# EAGLE design BreakoutV2 (EAGLE 6.1)
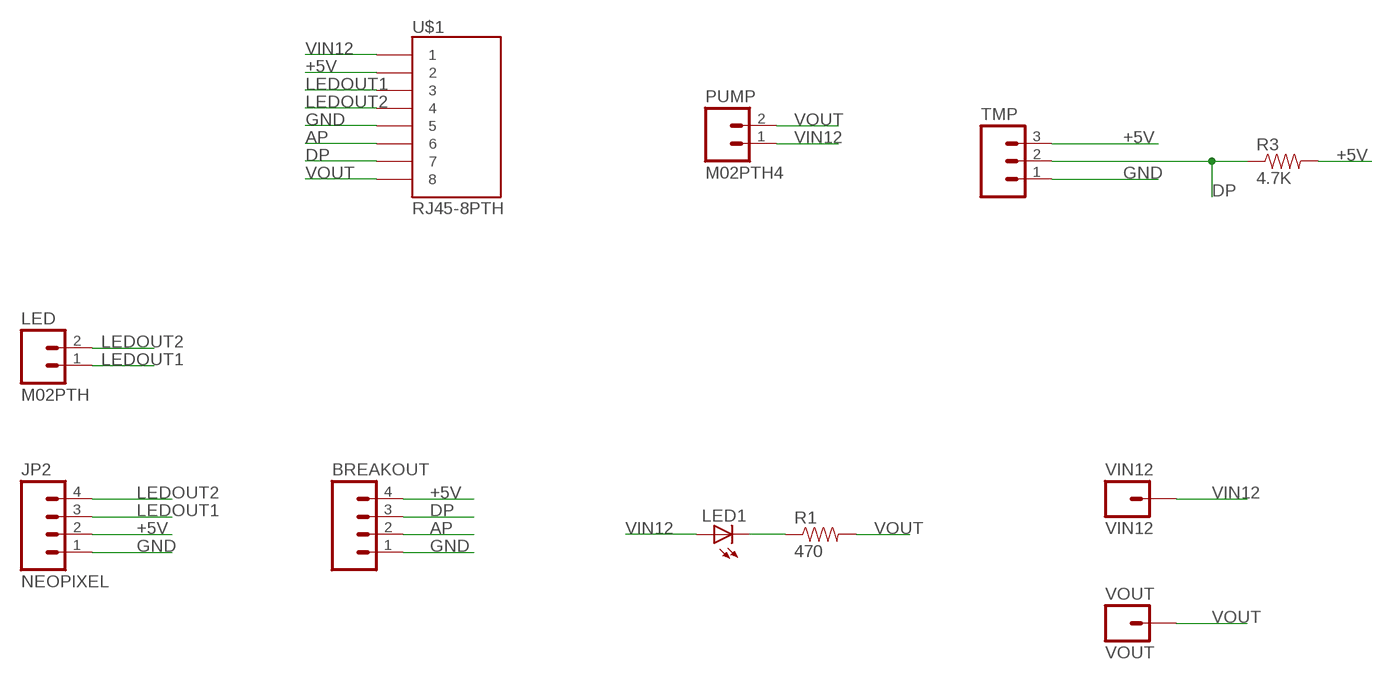
[diagram p0: schematic, sheet 1]

## Parts
BREAKOUT  M04PTH  [1X04]
JP2  NEOPIXEL  M04PTH  [1X04]
LED  M02PTH  [1X02]
LED1  LED5MM  [LED5MM]
PUMP  M02PTH4  [1X02_XTRA_BIG]
R1  470  RESISTORPTH-1/6W  [1/6W-RES]
R3  4.7K  RESISTORPTH-1/6W  [1/6W-RES]
TMP  M03PTH  [1X03]
U$1  RJ45-8PTH  [RJ45-8]
VIN12  VIN12  M01POGOPIN_HOLE_0.58  [1X01_POGOPIN_HOLE_0.58]
VOUT  VOUT  M01POGOPIN_HOLE_0.58  [1X01_POGOPIN_HOLE_0.58]

## Nets
+5V: BREAKOUT.4 JP2.2 R3.2 TMP.3 U$1.2
AP: BREAKOUT.2 U$1.6
DP: BREAKOUT.3 R3.1 TMP.2 U$1.7
GND: BREAKOUT.1 JP2.1 TMP.1 U$1.5
LEDOUT1: JP2.3 LED.1 U$1.3
LEDOUT2: JP2.4 LED.2 U$1.4
N$1: LED1.K(C) R1.1
VIN12: LED1.A PUMP.1 U$1.1 VIN12.1
VOUT: PUMP.2 R1.2 U$1.8 VOUT.1

## Library data of the parts
BREAKOUT JP2 = SparkFun-Connectors:M04: Header 4 Standard 4-pin 0.1" header. Use with straight break away headers (SKU : PRT-00116), right angle break away headers (PRT-00553), swiss pins (PRT-00743), machine pins (PRT-00117), and female headers (PRT-00115). Molex polarized connector foot print use with SKU : PRT-08231 with associated crimp pins and housings. 1MM SMD Version SKU: PRT-10208
LED PUMP = SparkFun-Connectors:M02: Standard 2-pin 0.1" header. Use with - straight break away headers ( PRT-00116) - right angle break away headers (PRT-00553) - swiss pins (PRT-00743) - machine pins (PRT-00117) - female headers (PRT-00115) Molex polarized connector foot print use with: PRT-08233 with associated crimp pins and housings. 2.54_SCREWTERM for use with PRT-10571. 3.5mm Screw Terminal footprints for PRT-08084 5mm Screw Terminal footprints for use with PRT-08433
LED1 = SparkFun-LED:LED: LEDs Standard schematic elements and footprints for 5mm, 3mm, 1206, and 0603 sized LEDs. 5mm - Spark Fun Electronics SKU : COM-00529 (and others)
R1 R3 = SparkFun-Resistors:RESISTOR: Resistor Basic schematic elements and footprints for 0603, 1206, and PTH resistors.
TMP = SparkFun-Connectors:M03: Header 3 Standard 3-pin 0.1" header. Use with straight break away headers (SKU : PRT-00116), right angle break away headers (PRT-00553), swiss pins (PRT-00743), machine pins (PRT-00117), and female headers (PRT-00115). Molex polarized connector foot print use with SKU : PRT-08232 with associated crimp pins and housings.
U$1 = SparkFun-Connectors:RJ45-8: RJ45 Jack Simple RJ45, 8-pin connection - connector for common Cat5, Cat5e, and Cat6 Ethernet cables. Footprint not yet proven in production. Connector sku is PRT-00643; Breakout PCB sku is BOB-00716.
VIN12 VOUT = SparkFun-Connectors:M01: Header 1 Standard 1-pin 0.1" header. Use with straight break away headers (SKU : PRT-00116), right angle break away headers (PRT-00553), swiss pins (PRT-00743), machine pins (PRT-00117), and female headers (PRT-00115).

## Board
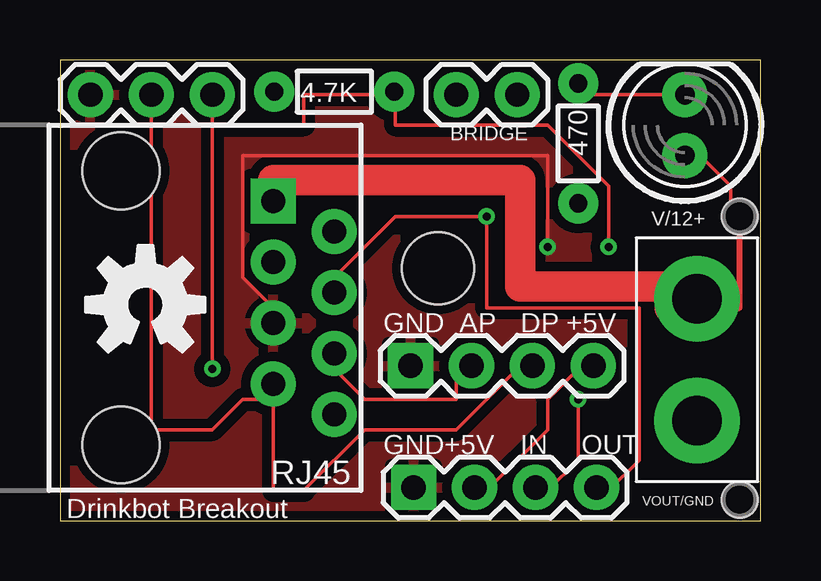
[diagram p1: board, top side]
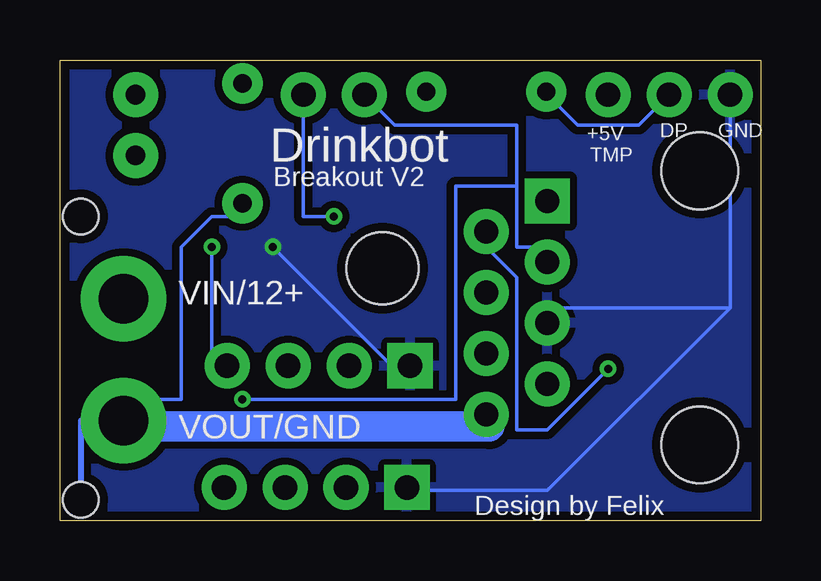
[diagram p2: board, bottom side, seen from below]

Size 29.19 x 19.23 mm. Coordinates in mm from the lower left corner, seen from the top.
Outline: 0,0 29.19,0 29.19,19.23 0,19.23 0,0
Copper layers (1*16): Top 0.0356mm / dielectric 1.5011mm / Bottom 0.0356mm
Design rules: minimum track width 6mil, minimum drill 13mil, track to track 6mil, track to pad 6mil, pad to pad 6mil, via to via 6mil, smd to smd 6mil, copper to edge 15mil, drill to drill 6mil, minimum pad ring 7mil, minimum via ring 7mil, stop-mask expansion 4mil, vias tented up to drill 0mil, thermal gap 10mil
Holes 3 mm at 15.75,10.54

### Footprints (pad centres in the part's own frame; a part is rotated, then mirrored left to right if it is on the bottom)
1X04 = drill 1.016 pad 1.88 square: 1 0,0 | drill 1.016 pad 1.88: 2 2.54,0; 3 5.08,0; 4 7.62,0
1X02 = drill 1.016 pad 1.88: 1 0,0; 2 2.54,0
LED5MM = drill 0.813 pad 1.88: A -1.27,0; K 1.27,0
1X02_XTRA_BIG = drill 2.057 pad 3.556: 1 -2.54,0; 2 2.54,0
1/6W-RES = drill 0.762 pad 1.676: 1 -2.5,0; 2 2.5,0
1X03 = drill 1.016 pad 1.88: 1 0,0; 2 2.54,0; 3 5.08,0
RJ45-8 = drill 1 pad 1.88 square: 1 -4.445,6.35 | drill 1 pad 1.88: 2 -3.175,8.89; 3 -1.905,6.35; 4 -0.635,8.89; 5 0.635,6.35; 6 1.905,8.89; 7 3.175,6.35; 8 4.445,8.89 | hole 3.2: -5.715,0; 5.715,0
1X01_POGOPIN_HOLE_0.58 = drill 0.9 pad 0.813: 1 0,0 | hole 1.473: 0,0

### Placement (x,y rotation side)
BREAKOUT  14.61,6.48 0 top
JP2  14.73,1.4 0 top
LED  16.51,17.78 0 top
LED1  26.04,16.51 90 top
PUMP  26.54,6.73 270 top
R1  21.59,15.75 270 top
R3  11.43,17.91 0 top
TMP  1.27,17.78 0 top
U$1  2.54,8.89 270 top
U$2  [OSHW-LOGO-M]  3.56,9.02 0 top
VIN12  28.32,12.7 0 top
VOUT  28.32,0.89 0 top

### Tracks (layer width: path | path; a pad name or v marks a point on that pad's centre or on a via)
+5V  (via drill 0.33)
  Top 0.152: JP2.2 17.78,1.27 20.32,3.81 20.32,5.08 21.59,6.35 BREAKOUT.4 | 13.97,17.78 10.16,17.78 10.16,16.51 6.35,16.51 | TMP.3 6.35,16.51 | 6.35,16.51 v6.35,6.35 | v22.86,11.43 22.86,13.97 20.32,16.51 13.97,16.51 13.97,17.78 | 13.97,17.78 R3.2
  Bottom 0.152: v6.35,6.35 8.89,3.81 10.16,3.81 10.16,10.16 11.43,11.43 U$1.2 | v22.86,11.43 22.86,6.35 BREAKOUT.4
AP
  Top 0.152: BREAKOUT.2 16.51,6.35 16.51,5.08 12.7,5.08 11.43,6.35 U$1.6
DP
  Top 0.152: 8.89,5.08 7.62,5.08 6.35,3.81 3.81,3.81 TMP.2 | 8.89,5.08 8.89,1.27 10.16,1.27 12.7,3.81 16.51,3.81 19.05,6.35 BREAKOUT.3 | 8.89,5.08 U$1.7
  Bottom 0.152: TMP.2 5.08,16.51 7.62,16.51 8.89,17.78 R3.1
GND  (via drill 0.33)
  Top 0.152: v20.32,11.43 20.32,15.24 7.62,15.24 7.62,10.16 8.89,8.89 U$1.5
  Bottom 0.152: 1.27,8.89 TMP.1 | 1.27,8.89 8.89,8.89 U$1.5 | 1.27,8.89 8.89,1.27 13.97,1.27 JP2.1 | v20.32,11.43 15.24,6.35 BREAKOUT.1
  pour Top (isolate 0.406): 0,19.05 29.21,19.05 29.21,0 0,0
  pour Bottom (isolate 0.305): 0,19.05 29.21,19.05 29.21,0 0,0
LEDOUT1  (via drill 0.33)
  Top 0.152: v21.59,5.08 21.59,2.54 20.32,1.27 JP2.3
  Bottom 0.152: 10.16,13.97 10.16,16.51 15.24,16.51 LED.1 | 10.16,13.97 10.16,11.43 8.89,11.43 U$1.3 | v21.59,5.08 12.7,5.08 12.7,13.97 10.16,13.97
LEDOUT2  (via drill 0.33)
  Top 0.152: U$1.4 11.43,10.16 13.97,12.7 v17.78,12.7 17.78,8.89 24.13,8.89 24.13,2.54 22.86,1.27 JP2.4
  Bottom 0.152: LED.2 19.05,12.7 v17.78,12.7
N$1
  Top 0.152: LED1.K 21.59,17.78 R1.1
VIN12
  Top 0.152: LED1.A 26.67,15.24 27.94,13.97 27.94,12.7 VIN12.1
  Top 0.254: 26.67,8.89 28.32,8.89 VIN12.1
  Top 1.27: U$1.1 8.89,14.22 19.18,14.22 19.18,9.78 26.67,9.78 26.67,8.89 25.4,8.89 25.4,9.27 PUMP.1
VOUT
  Bottom 0.152: R1.2 21.59,12.7 22.86,12.7 24.13,11.43 24.13,5.08 25.4,5.08 PUMP.2
  Bottom 0.254: PUMP.2 28.32,4.19 VOUT.1
  Bottom 1.27: U$1.8 11.3,4.45 11.3,3.94 26.54,3.94 PUMP.2

### Text on the board
tPlace: BRIDGE | GND | AP | DP | +5V | GND | +5V | IN | OUT | RJ45 | Drinkbot Breakout
bPlace: GND | DP | +5V | TMP | Drinkbot | Breakout V2 | VIN/12+ | VOUT/GND | Design by Felix
tNames: V/12+ | VOUT/GND